# Altium schematic sheet USB_to_UART.SchDoc
size A; SheetNumber: 3; SheetTotal: 4
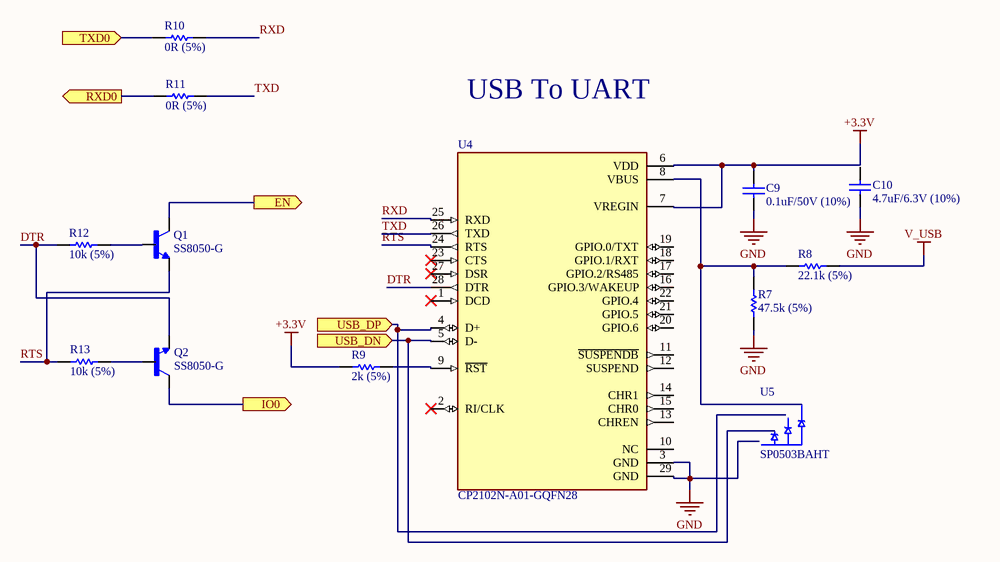
[diagram p0: USB_to_UART.SchDoc]

## Parts
C9  value 0.1uF/50V (10%)  [CAPC1608X90]  (hidden comment: Cap)
C10  value 4.7uF/6.3V (10%)  [CAPC1005X65N]  (hidden comment: Cap)
Q1  SS8050-G  [TRANS_SS8050-G]
Q2  SS8050-G  [TRANS_SS8050-G]
R7  value 47.5k (5%)  [RESC1607X60N]  (hidden comment: Res1)
R8  value 22.1k (5%)  [RESC1608X60N]  (hidden comment: Res1)
R9  value 2k (5%)  [RESC1608X55N]  (hidden comment: Res1)
R10  value 0R (5%)  [RESC1607X60N]  (hidden comment: Res1)
R11  value 0R (5%)  [RESC1607X60N]  (hidden comment: Res1)
R12  value 10k (5%)  [RESC1607X60N]  (hidden comment: Res1)
R13  value 10k (5%)  [RESC1607X60N]  (hidden comment: Res1)
U4  CP2102N-A01-GQFN28  [QFN50P500X500X80-29N]
U5  SP0503BAHT  [SOT143]

## Ports
EN (out), IO0 (out), RXD0 (out), TXD0 (in), USB_DN (in), USB_DP (in)

## Nets
+3.3V: C9.2 R9.2 U4.6(VDD) U4.7(VREGIN)
GND: C9.1 C10.1 R7.1 U4.3(GND) U4.29(GND)
V_USB: R8.1
DTR: Q2.2(E) R12.2 U4.28(DTR)
EN: Q1.3(C) ; port EN
RTS: Q1.2(E) R13.2 U4.24(RTS)
RXD: R10.1 U4.25(RXD)
RXD0: R11.2 ; port RXD0
TXD: R11.1 U4.26(TXD)
TXD0: R10.2 ; port TXD0
USB_DN: U4.5(D-) ; port USB_DN
USB_DP: U4.4(D+) ; port USB_DP
NetQ1_1: Q1.1(B) R12.1
NetQ2_1: Q2.1(B) R13.1
NetR7_2: R7.2 R8.2 U4.8(VBUS) U5.4(C)
NetR9_1: R9.1 U4.9(~{RST})

Not connected (* = marked no-connect by the designer): C10 2; Q2 3(C); U4 1(DCD)* 2(RI/CLK)* 10(NC) 11(~{SUSPENDB}) 12(SUSPEND) 13(CHREN) 14(CHR1) 15(CHR0) 16(GPIO.3/WAKEUP) 17(GPIO.2/RS485) 18(GPIO.1/RXT) 19(GPIO.0/TXT) 20(GPIO.6) 21(GPIO.5) 22(GPIO.4) 23(CTS)* 27(DSR)*; U5 1(GND) 2(A) 3(B)

## Notes on the sheet
- USB To UART

## Library data of the parts
C9 C10 = Cap: Capacitor; Published: 8-Jun-2000; LatestRevisionDate: 17-Jul-2002; LatestRevisionNote: Re-released for DXP Platform.; PackageReference: RAD-0.3; Publisher: Altium Limited; PackageDescription: Radial Cap, Thru-Hole; 2 Leads; 0.3 in Pin Spacing
Q1 Q2 = SS8050-G: Bipolar (BJT) Transistor NPN 25 V 1.5 A 100MHz 300 mW Surface Mount SOT-23-3; MP: SS8050G; MF: Comchip; Digi-Key_Part_Number: 641-1790-2-ND; Check_prices: https://www.snapeda.com/parts/SS8050G/Comchip/view-part/?ref=eda; Package: None; SnapEDA_Link: https://www.snapeda.com/parts/SS8050G/Comchip/view-part/?ref=snap; Value: *
R7-R13 = Res1: Resistor; Published: 8-Jun-2000; LatestRevisionDate: 17-Jul-2002; LatestRevisionNote: Re-released for DXP Platform.; PackageReference: AXIAL-0.3; Publisher: Altium Limited; PackageDescription: Axial Device, Thru-Hole; 2 Leads; 0.3 in Pin Spacing
U4 = CP2102N-A01-GQFN28: USB Bridge, USB to UART USB 2.0 UART Interface 28-QFN (5x5); MF: Silicon Labs; Price: None; Package: QFN-28 Silicon Labs; Purchase-URL: https://pricing.snapeda.com/search/part/CP2102N-A01-GQFN28/?ref=eda; Availability: In Stock; SnapEDA_Link: https://www.snapeda.com/parts/CP2102N-A01-GQFN28/Silicon+Labs/view-part/?ref=snap; Value: *; MP: CP2102N-A01-GQFN28; Check_prices: https://www.snapeda.com/parts/CP2102N-A01-GQFN28/Silicon+Labs/view-part/?ref=eda
U5 = SP0503BAHT: ESD Suppressors / TVS Diodes TVS AVAL DIODE SMT; MF: Littelfuse; SnapEDA_Link: https://www.snapeda.com/parts/SP0503BAHT/Ersa/view-part/?ref=snap; Package: SOT-143 Littelfuse; Value: *; MP: SP0503BAHT; Check_prices: https://www.snapeda.com/parts/SP0503BAHT/Ersa/view-part/?ref=eda